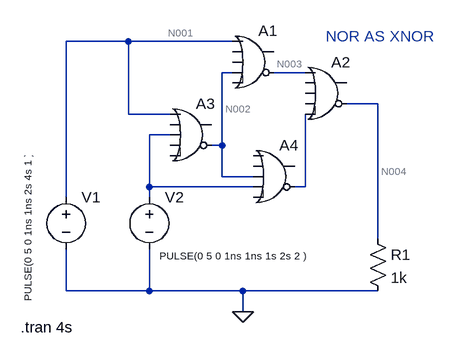
[diagram p0: schematic 209.asc]
209.asc, the LTspice schematic file:
Version 4
SHEET 1 880 680
WIRE 80 -112 -16 -112
WIRE 240 -112 80 -112
WIRE 240 -64 224 -64
WIRE 352 -64 304 -64
WIRE 464 -16 416 -16
WIRE 80 0 80 -112
WIRE 144 0 80 0
WIRE 144 32 112 32
WIRE 224 48 224 -64
WIRE 224 48 208 48
WIRE 224 96 224 48
WIRE 272 96 224 96
WIRE 112 112 112 32
WIRE 272 112 112 112
WIRE 352 112 352 0
WIRE 352 112 336 112
WIRE -16 128 -16 -112
WIRE 112 128 112 112
WIRE 464 192 464 -16
WIRE -16 272 -16 208
WIRE 112 272 112 208
WIRE 112 272 -16 272
WIRE 256 272 112 272
WIRE 464 272 256 272
WIRE 256 304 256 272
FLAG 256 304 0
SYMBOL Digital\\or 272 -144 R0
SYMATTR InstName A1
SYMBOL Digital\\or 384 -96 R0
SYMATTR InstName A2
SYMBOL res 448 176 R0
SYMATTR InstName R1
SYMATTR Value 1k
SYMBOL voltage -16 112 R0
WINDOW 3 -59 176 VLeft 1
SYMATTR InstName V1
SYMATTR Value PULSE(0 5 0 1ns 1ns 2s 4s 1 )
SYMBOL voltage 112 112 R0
WINDOW 3 16 106 Left 1
SYMATTR InstName V2
SYMATTR Value PULSE(0 5 0 1ns 1ns 1s 2s 2 )
SYMBOL Digital\\or 176 -32 R0
SYMATTR InstName A3
SYMBOL Digital\\or 304 32 R0
SYMATTR InstName A4
TEXT 384 -120 Left 2 ;NOR AS XNOR
TEXT -86 328 Left 2 !.tran 4s

The netlist it stands for:
* 209.asc
A1 N001 0 0 N002 0 N003 0 0 OR
A2 N003 0 0 0 N006 N004 0 0 OR
R1 N004 0 1k
V1 N001 0 PULSE(0 5 0 1ns 1ns 2s 4s 1 )
V2 N005 0 PULSE(0 5 0 1ns 1ns 1s 2s 2 )
A3 N001 0 N005 0 0 N002 0 0 OR
A4 0 0 N002 N005 0 N006 0 0 OR
* NOR AS XNOR
.tran 4s
.backanno
.end

* Results of the author's LTspice run, read from the files saved beside the schematic
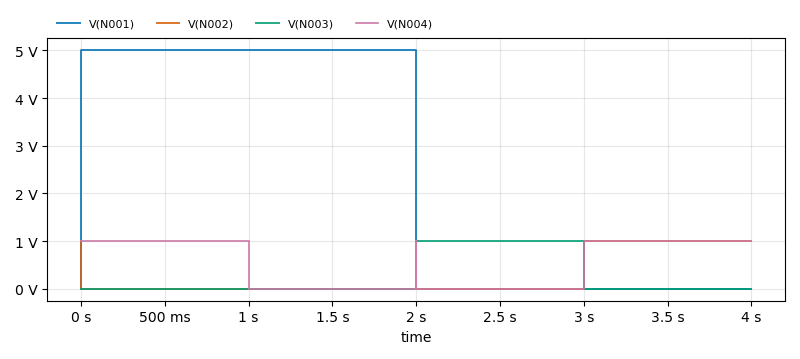
[diagram p1: Transient Analysis of 209.asc, plotted from the saved traces]
* Transient Analysis, 1 run:
*   V(N001): min 0 V, max 5 V, average 2.5 V, rms 3.536 V, last 0 V
*   V(N002): min 0 V, max 1 V, average 250 mV, rms 500 mV, last 1 V
*   V(N003): min 0 V, max 1 V, average 250 mV, rms 500 mV, last 0 V
*   V(N004): min 0 V, max 999 mV, average 499.5 mV, rms 706.4 mV, last 999 mV